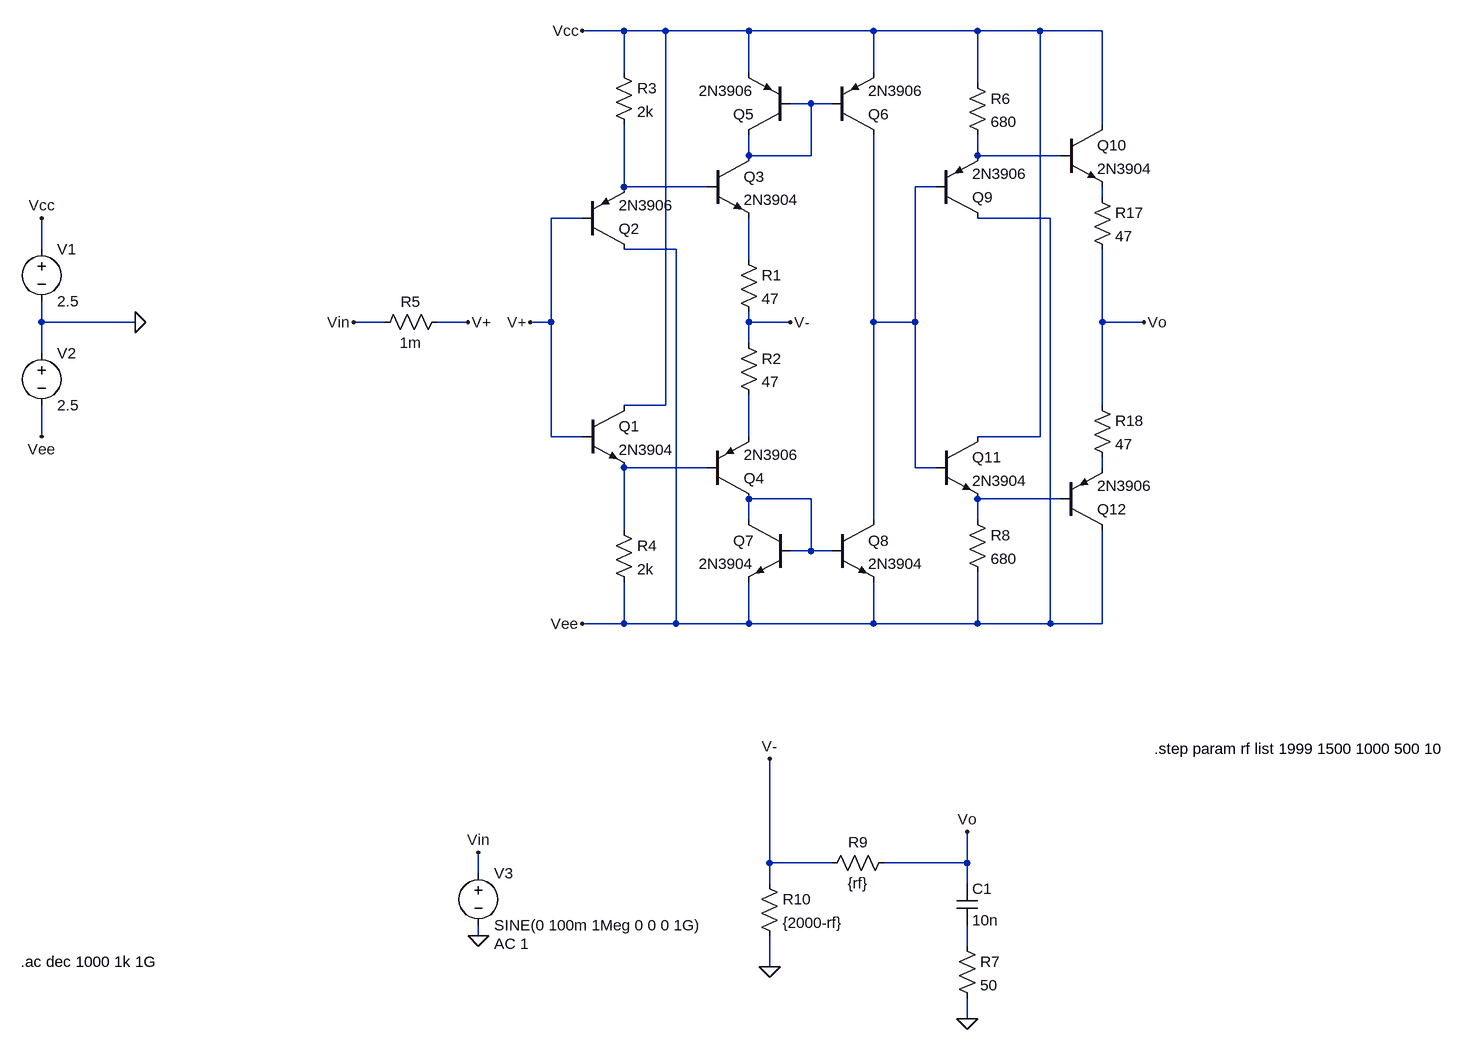
[diagram p0: schematic current_feedback_amplifier.asc]
current_feedback_amplifier.asc, the LTspice schematic file:
Version 4
SHEET 1 2256 1044
WIRE 224 -496 160 -496
WIRE 288 -496 224 -496
WIRE 416 -496 288 -496
WIRE 608 -496 416 -496
WIRE 768 -496 608 -496
WIRE 864 -496 768 -496
WIRE 960 -496 864 -496
WIRE 224 -432 224 -496
WIRE 416 -432 416 -496
WIRE 608 -432 608 -496
WIRE 768 -416 768 -496
WIRE 512 -384 480 -384
WIRE 544 -384 512 -384
WIRE 960 -352 960 -496
WIRE 416 -304 416 -336
WIRE 512 -304 512 -384
WIRE 512 -304 416 -304
WIRE 768 -304 768 -336
WIRE 896 -304 768 -304
WIRE 224 -256 224 -352
WIRE 352 -256 224 -256
WIRE 704 -256 672 -256
WIRE 960 -240 960 -256
WIRE 160 -208 112 -208
WIRE 880 -208 768 -208
WIRE -672 -160 -672 -208
WIRE 304 -160 224 -160
WIRE 416 -144 416 -208
WIRE -672 -48 -672 -80
WIRE -528 -48 -672 -48
WIRE -144 -48 -192 -48
WIRE -16 -48 -64 -48
WIRE 112 -48 112 -208
WIRE 112 -48 80 -48
WIRE 416 -48 416 -64
WIRE 480 -48 416 -48
WIRE 608 -48 608 -336
WIRE 672 -48 672 -256
WIRE 672 -48 608 -48
WIRE 960 -48 960 -160
WIRE 1024 -48 960 -48
WIRE 416 -16 416 -48
WIRE -672 0 -672 -48
WIRE 288 80 288 -496
WIRE 288 80 224 80
WIRE 960 80 960 -48
WIRE -672 128 -672 80
WIRE 112 128 112 -48
WIRE 160 128 112 128
WIRE 416 128 416 64
WIRE 864 128 864 -496
WIRE 864 128 768 128
WIRE 352 176 224 176
WIRE 672 176 672 -48
WIRE 704 176 672 176
WIRE 960 176 960 160
WIRE 512 224 416 224
WIRE 896 224 768 224
WIRE 416 256 416 224
WIRE 608 256 608 -48
WIRE 768 256 768 224
WIRE 224 272 224 176
WIRE 512 304 512 224
WIRE 512 304 480 304
WIRE 544 304 512 304
WIRE 224 416 224 352
WIRE 224 416 160 416
WIRE 304 416 304 -160
WIRE 304 416 224 416
WIRE 416 416 416 352
WIRE 416 416 304 416
WIRE 608 416 608 352
WIRE 608 416 416 416
WIRE 768 416 768 336
WIRE 768 416 608 416
WIRE 880 416 880 -208
WIRE 880 416 768 416
WIRE 960 416 960 272
WIRE 960 416 880 416
WIRE 448 784 448 624
WIRE 544 784 448 784
WIRE 752 784 752 736
WIRE 752 784 624 784
WIRE 0 800 0 768
WIRE 448 816 448 784
WIRE 752 816 752 784
WIRE 0 896 0 880
WIRE 752 912 752 880
WIRE 448 944 448 896
WIRE 752 1024 752 992
FLAG 160 416 Vee
FLAG 160 -496 Vcc
FLAG 80 -48 V+
FLAG 1024 -48 Vo
FLAG -672 -208 Vcc
FLAG -672 128 Vee
FLAG -528 -48 0
FLAG 0 896 0
FLAG 0 768 Vin
FLAG 480 -48 V-
FLAG 448 624 V-
FLAG 448 944 0
FLAG 752 736 Vo
FLAG 752 1024 0
FLAG -16 -48 V+
FLAG -192 -48 Vin
SYMBOL npn 160 80 R0
SYMATTR InstName Q1
SYMATTR Value 2N3904
SYMBOL pnp 160 -160 M180
SYMATTR InstName Q2
SYMATTR Value 2N3906
SYMBOL npn 352 -304 R0
SYMATTR InstName Q3
SYMATTR Value 2N3904
SYMBOL pnp 352 224 M180
SYMATTR InstName Q4
SYMATTR Value 2N3906
SYMBOL res 400 -160 R0
SYMATTR InstName R1
SYMATTR Value 47
SYMBOL res 400 -32 R0
SYMATTR InstName R2
SYMATTR Value 47
SYMBOL res 208 -448 R0
SYMATTR InstName R3
SYMATTR Value 2k
SYMBOL res 208 256 R0
SYMATTR InstName R4
SYMATTR Value 2k
SYMBOL pnp 480 -336 R180
SYMATTR InstName Q5
SYMATTR Value 2N3906
SYMBOL pnp 544 -336 M180
SYMATTR InstName Q6
SYMATTR Value 2N3906
SYMBOL npn 480 256 M0
SYMATTR InstName Q7
SYMATTR Value 2N3904
SYMBOL npn 544 256 R0
SYMATTR InstName Q8
SYMATTR Value 2N3904
SYMBOL voltage -672 -176 R0
WINDOW 123 0 0 Left 0
WINDOW 39 0 0 Left 0
SYMATTR InstName V1
SYMATTR Value 2.5
SYMBOL voltage -672 -16 R0
WINDOW 123 0 0 Left 0
WINDOW 39 0 0 Left 0
SYMATTR InstName V2
SYMATTR Value 2.5
SYMBOL voltage 0 784 R0
WINDOW 123 24 124 Left 2
WINDOW 39 0 0 Left 0
SYMATTR Value2 AC 1
SYMATTR InstName V3
SYMATTR Value SINE(0 100m 1Meg 0 0 0 1G)
SYMBOL pnp 704 -208 M180
SYMATTR InstName Q9
SYMATTR Value 2N3906
SYMBOL npn 896 -352 R0
SYMATTR InstName Q10
SYMATTR Value 2N3904
SYMBOL npn 704 128 R0
SYMATTR InstName Q11
SYMATTR Value 2N3904
SYMBOL pnp 896 272 M180
SYMATTR InstName Q12
SYMATTR Value 2N3906
SYMBOL res 752 -432 R0
SYMATTR InstName R6
SYMATTR Value 680
SYMBOL res 752 240 R0
SYMATTR InstName R8
SYMATTR Value 680
SYMBOL res 432 800 R0
SYMATTR InstName R10
SYMATTR Value {2000-rf}
SYMBOL res 944 -256 R0
SYMATTR InstName R17
SYMATTR Value 47
SYMBOL res 944 64 R0
SYMATTR InstName R18
SYMATTR Value 47
SYMBOL res 736 896 R0
SYMATTR InstName R7
SYMATTR Value 50
SYMBOL res 640 768 R90
WINDOW 0 0 56 VBottom 2
WINDOW 3 32 56 VTop 2
SYMATTR InstName R9
SYMATTR Value {rf}
SYMBOL res -48 -64 R90
WINDOW 0 0 56 VBottom 2
WINDOW 3 32 56 VTop 2
SYMATTR InstName R5
SYMATTR Value 1m
SYMBOL cap 736 816 R0
SYMATTR InstName C1
SYMATTR Value 10n
TEXT -704 936 Left 2 !.ac dec 1000 1k 1G
TEXT 1040 608 Left 2 !.step param rf list 1999 1500 1000 500 10

The netlist it stands for:
* current_feedback_amplifier.asc
Q1 Vcc V+ N008 0 2N3904
Q2 Vee V+ N003 0 2N3906
Q3 N001 N003 N006 0 2N3904
Q4 N010 N008 N007 0 2N3906
R1 N006 V- 47
R2 V- N007 47
R3 Vcc N003 2k
R4 N008 Vee 2k
Q5 N001 N001 Vcc 0 2N3906
Q6 N004 N001 Vcc 0 2N3906
Q7 N010 N010 Vee 0 2N3904
Q8 N004 N010 Vee 0 2N3904
V1 Vcc 0 2.5
V2 0 Vee 2.5
V3 Vin 0 SINE(0 100m 1Meg 0 0 0 1G) AC 1
Q9 Vee N004 N002 0 2N3906
Q10 Vcc N002 N005 0 2N3904
Q11 Vcc N004 N011 0 2N3904
Q12 Vee N011 N009 0 2N3906
R6 Vcc N002 680
R8 N011 Vee 680
R10 V- 0 {2000-rf}
R17 N005 Vo 47
R18 Vo N009 47
R7 N012 0 50
R9 Vo V- {rf}
R5 V+ Vin 1m
C1 Vo N012 10n
.model NPN NPN
.model PNP PNP
.lib standard.bjt
.ac dec 1000 1k 1G
.step param rf list 1999 1500 1000 500 10
.backanno
.end